# Altium project ReflowIron-02-PSU.PrjPcb
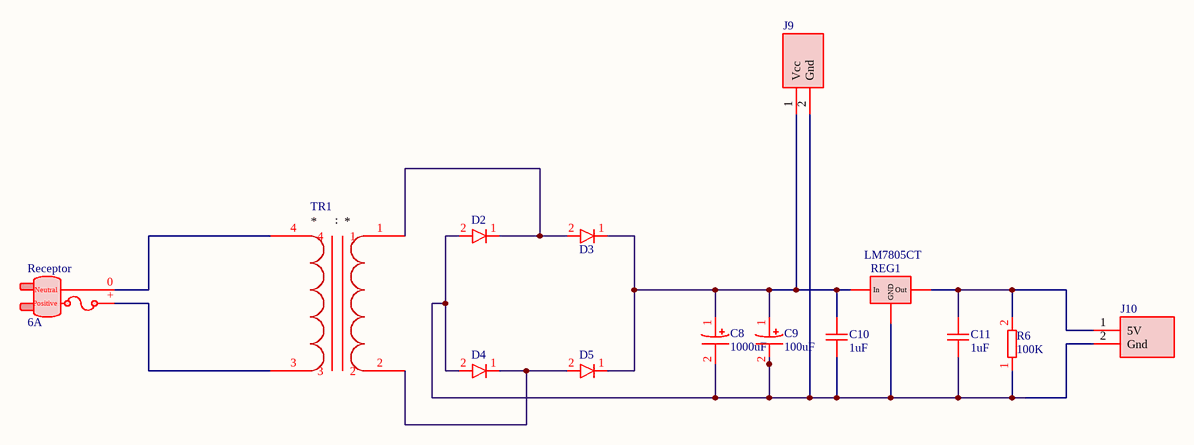
[diagram p0: psu.SchDoc]
1 sheet, 14 parts. Net scope: global (net labels, ports and power ports of the same name join across sheets).
Board file: PSU.PcbDoc

## Sheet psu.SchDoc: Power supply unit
size A4; Author: Axel Colson; Organization: PXL; Revision: 1.0.0; SheetNumber: 1; SheetTotal: 1; Component: PSU; PartOf: Reflow solder iron; CreatedAt: 11/03/2024; LastUpdated: 12/03/2023

### Parts
C8  1000uF  [CAP_RAD_10x20mm_ELC]
C9  100uF  [CAP_RAD_ELC_5x11mm]
C10  1uF  [CAP_RAD_MLCC]
C11  1uF  [CAP_RAD_MLCC]
D2  D_Diode_SMC4  [DIO_S8KS-E3/I_MED]  (value not drawn)
D3  D_Diode_SMC4  [DIO_S8KS-E3/I_MED]  (value not drawn)
D4  D_Diode_SMC4  [DIO_S8KS-E3/I_MED]  (value not drawn)
D5  D_Diode_SMC4  [DIO_S8KS-E3/I_MED]  (value not drawn)
J9  CON_F1x2Pin  [CON_F1x2Pin]  (value not drawn)
J10  CON_F1x2Pin  [CON_F1x2Pin]  (value not drawn)
R6  100K  [RES_0805US_MED]
Receptor  6A  (mechanical)
REG1  LM7805CT  [IC_5V_REGULATOR]
TR1  TRANS_NoTap  (value not drawn)  (mechanical)

### Nets
NetC8_1: C8.1(+) C9.1(+) C10.2 D3.1(K) D5.1(K) J9.1(Vcc) REG1.3(In)
NetC8_2: C8.2(-) C9.2(-) C10.1 C11.1 D2.2(A) D4.2(A) J9.2(Gnd) J10.2(Gnd) R6.1 REG1.2(GND)
NetC11_2: C11.2 J10.1(5V) R6.2 REG1.1(Out)
NetD2_1: D2.1(K) D3.2(A) TR1.1
NetD4_1: D4.1(K) D5.2(A) TR1.2
NetReceptor_0: Receptor.0(Neutral) TR1.4
NetReceptor_+: Receptor.+(Positive) TR1.3

### Notes on the sheet
- Title
- Part of
- Component
- Creation date
- Revision
- Sheet
- Of
- Organisation
- Last updated
- Author
- (in symbol TRANS_NoTap) :

### Library data of the parts
C8 C9 = D_Capacitor_Rad_ELC: Electrolothic radial mount Capacitor Polarised; Manufacturer_Name: Wurth Elektronik; Manufacturer_Part_Number: 860020475018; Datasheet Link: https://ms.componentsearchengine.com/Datasheets/2/860020475018.pdf; Height: 21.5mm; Mouser Part Number: 710-860020475018; Mouser Price/Stock: https://www.mouser.co.uk/ProductDetail/Wurth-Elektronik/860020475018?qs=0KOYDY2FL29%2F2GIHZNCdMQ%3D%3D
C10 C11 = D_Capacitor_RAD_MLCC
D2-D5 = D_Diode_SMC4: General purpose SMC-4 diode; Manufacturer_Name: Vishay; Manufacturer_Part_Number: S8KS-E3/I; Datasheet Link: https://www.vishay.com/docs/98461/s8gs_s8js_s8ks_s8ms.pdf; Height: 2.62mm; Mouser Part Number: 78-S8KS-E3/I; Mouser Price/Stock: https://www.mouser.co.uk/ProductDetail/Vishay-General-Semiconductor/S8KS-E3-I?qs=ulEaXIWI0c%252BEdM%252B9aITJZQ%3D%3D
J9 J10 = CON_F1x2Pin: Connector; Manufacturer_Name: Adam Tech; Manufacturer_Part_Number: SMC-1-02-1-GT; Datasheet Link: https://app.adam-tech.com/products/download/data_sheet/203379/smc-1-xx-1-gt-data-sheet.pdf; Height: 4.381mm; Arrow Part Number: SMC-1-02-1-GT; Arrow Price/Stock: https://www.arrow.com/en/products/smc-1-02-1-gt/adam-tech
R6 = D_Resistor_TF0805: SMD 0603 Thick Film 4.7kΩ 5.00% 0.1W; Voltage Rating: 50V; Max Power Dissipation: 100mW; Temperature Coefficient: 100ppm/°C; Resistance: 4.7kR; Tolerance: 5%; Width: 0.8mm; Case Code (Metric): 1608; Termination: SMD/SMT; Case/Package: 0603; Series: AC; Max Operating Temperature: 155°C; Length: 1.6mm; Resistor Type: Thick Film; Ratings: AEC-Q200; Weight: 7.1E-05oz; Case Code (Imperial): 0603; Features: Moisture Resistant; Packaging: Tape and Reel; Min Operating Temperature: -55°C; Number of Terminations: 2; RoHS Compliant: Yes; Lead Free: Lead Free; Height: 0.45mm; Power Rating: 100mW
Receptor = INLET_ACPower
REG1 = IC_Regulator: Non adjustable SC voltage reg 3pin
TR1 = TRANS_NoTap: Primary: *; Secondary: *